# EAGLE design eeprom arduino (EAGLE 9.3.2)
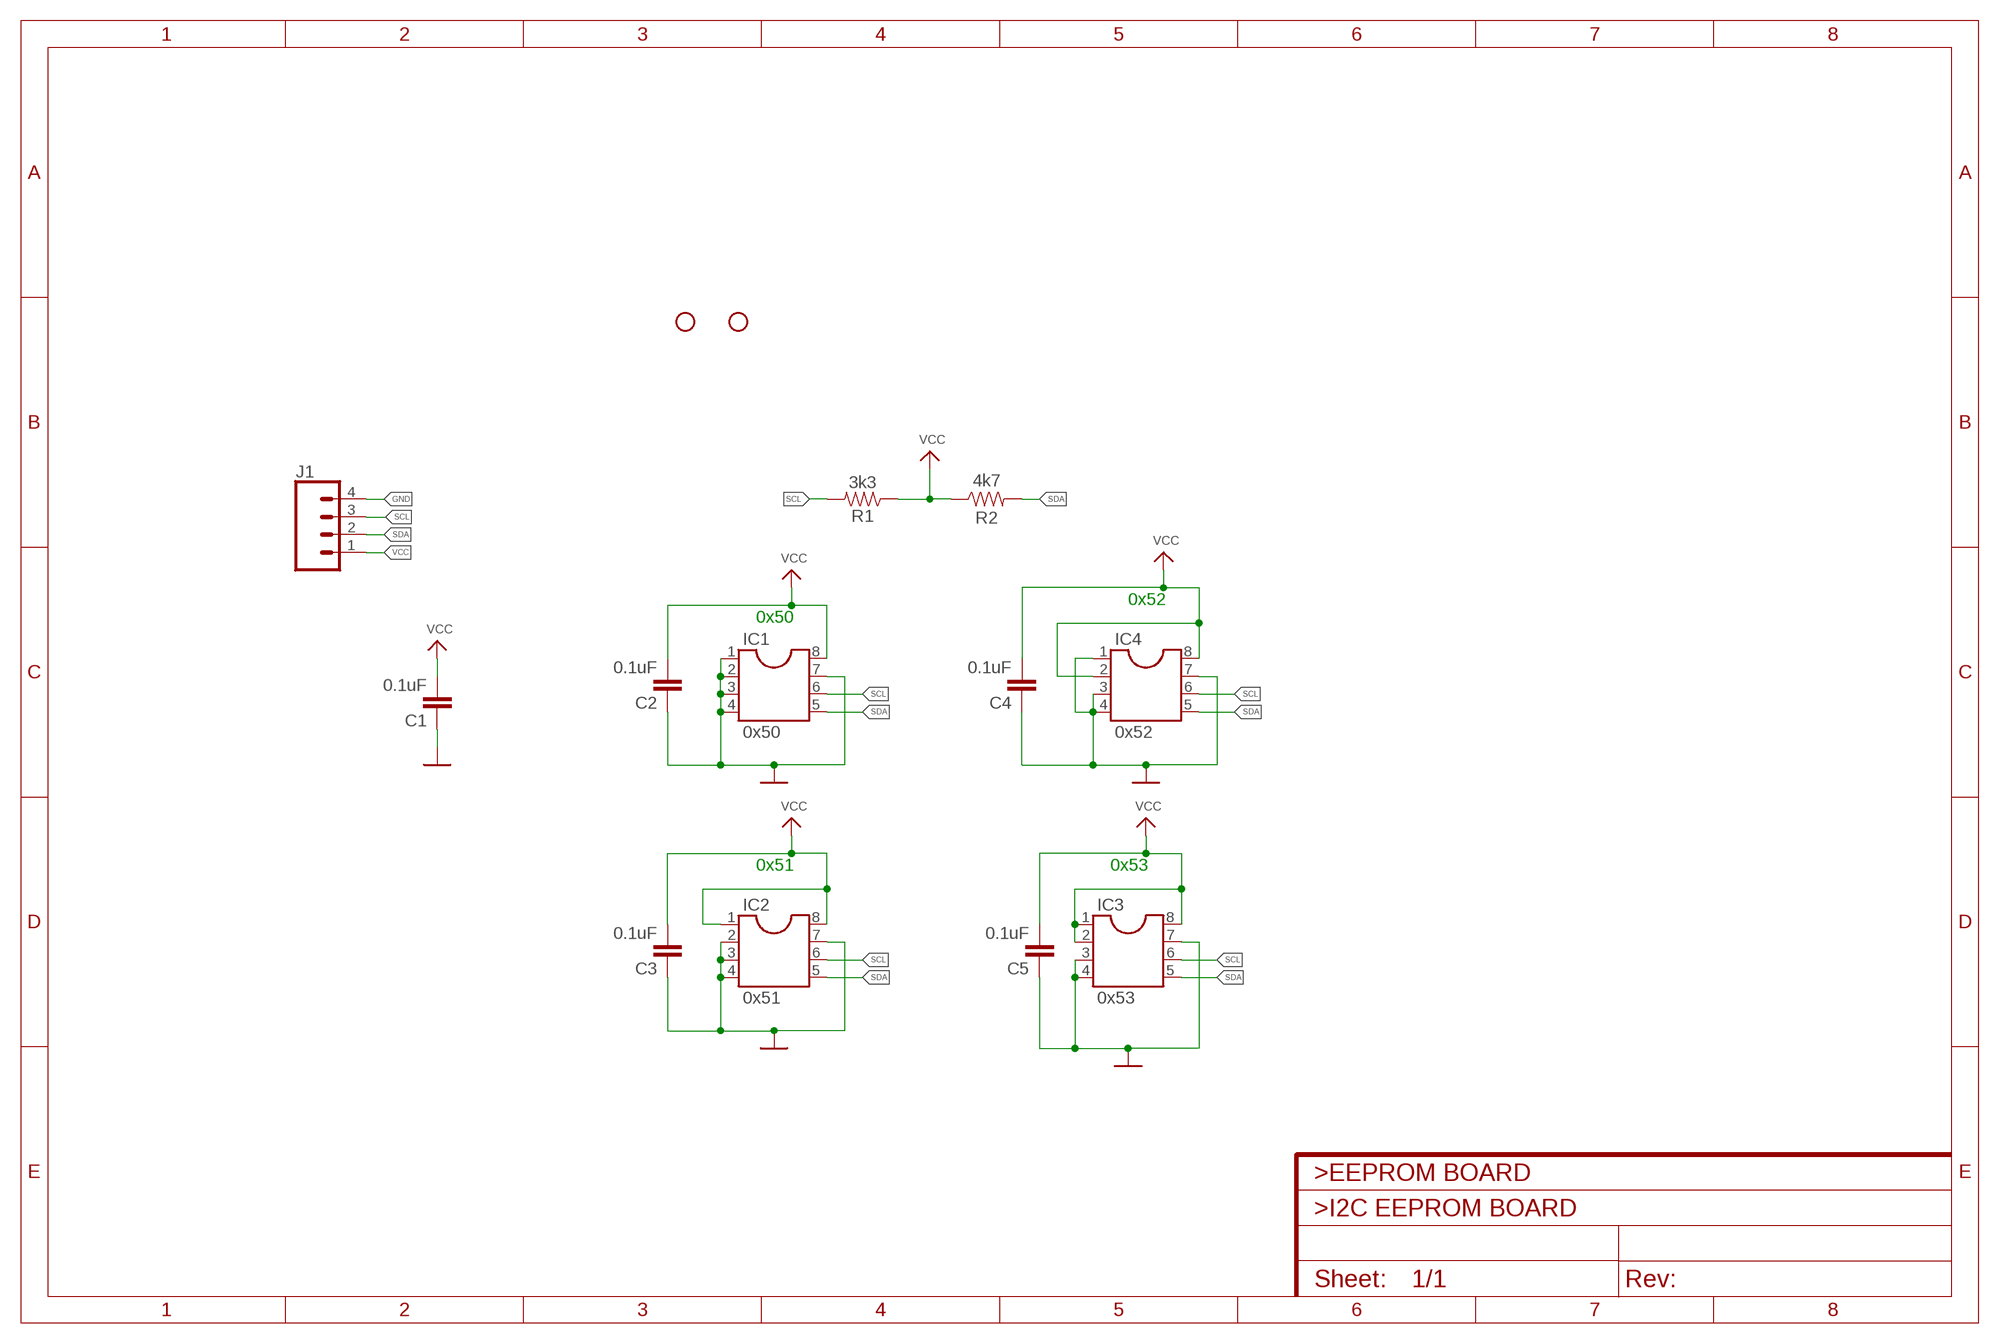
[diagram p0: schematic, sheet 1]

## Parts
C1  0.1uF  0.1UF-KIT-EZ-50V-20%  [CAP-PTH-SMALL-KIT]
C2  0.1uF  0.1UF-KIT-EZ-50V-20%  [CAP-PTH-SMALL-KIT]
C3  0.1uF  0.1UF-KIT-EZ-50V-20%  [CAP-PTH-SMALL-KIT]
C4  0.1uF  0.1UF-KIT-EZ-50V-20%  [CAP-PTH-SMALL-KIT]
C5  0.1uF  0.1UF-KIT-EZ-50V-20%  [CAP-PTH-SMALL-KIT]
H1  STAND-OFF  [STAND-OFF]
H2  STAND-OFF  [STAND-OFF]
IC1  0x50  DIL8S  [SOCKET-08]
IC2  0x51  DIL8S  [SOCKET-08]
IC3  0x53  DIL8S  [SOCKET-08]
IC4  0x52  DIL8S  [SOCKET-08]
J1  CONN_04POLAR  [MOLEX-1X4]
R1  3k3  10KOHM-HORIZ-1/4W-1%  [AXIAL-0.3]
R2  4k7  10KOHM-HORIZ-1/4W-1%  [AXIAL-0.3]

## Nets
GND [pwr]: C1.1 C2.1 C3.1 C4.1 C5.1 IC1.1 IC1.2 IC1.3 IC1.4 IC1.7 IC2.2 IC2.3 IC2.4 IC2.7 IC3.3 IC3.4 IC3.7 IC4.1 IC4.3 IC4.4 IC4.7 J1.4
SCL: IC1.6 IC2.6 IC3.6 IC4.6 J1.3 R1.P$2
SDA: IC1.5 IC2.5 IC3.5 IC4.5 J1.2 R2.P$2
VCC [pwr]: C1.2 C2.2 C3.2 C4.2 C5.2 IC1.8 IC2.1 IC2.8 IC3.1 IC3.2 IC3.8 IC4.2 IC4.8 J1.1 R1.P$1 R2.P$1

## Notes on the sheet
- 0x52
- 0x50
- 0x51 | 0x53

## Library data of the parts
C1-C5 = SparkFun-Capacitors:0.1UF: 0.1µF ceramic capacitors A capacitor is a passive two-terminal electrical component used to store electrical energy temporarily in an electric field.; PROD_ID: CAP-08370
H1 H2 = SparkFun-Hardware:STAND-OFF: Stand Off Drill holes for mechanically mounting via screws, standoffs, etc. Note: Use the keepout ring to avoid running the screw head into surrounding components. Variant Overviews STAND-OFF - Mechanical footprint for a #4 phillips button head screw. STAND-OFF-TIGHT - Mechanical footprint for a #4 phillips button head screw, Example SparkFun Products Screw - Phillips Head (1/4", 4-40, 10 pack) <https://www.sparkfun.com/products/10453> (PRT-10453) Screw - Phillips Head (1/2", 4-40, 10 pack) <https://www.sparkfun.com/products/10452> (PRT-10452) Screw - Phillips Head (3/4", 4-40, 10 pack) <https://www.sparkfun.com/products/10451> (PRT-10451) Screw - Phillips Head (1", 4-40, 10 pack) <https://www.sparkfun.com/products/10450> (PRT-10450)
IC1-IC4 = ic-package:DIL8: Dual In Line / Socket
J1 = SparkFun-Connectors:CONN_04: Multi connection point. Often used as Generic Header-pin footprint for 0.1 inch spaced/style header connections On any of the 0.1 inch spaced packages, you can populate with these: Break Away Headers - Straight <https://www.sparkfun.com/products/116> (PRT-00116) Break Away Male Headers - Right Angle <https://www.sparkfun.com/products/553> (PRT-00553) Female Headers <https://www.sparkfun.com/products/115> (PRT-00115) Break Away Headers - Machine Pin <https://www.sparkfun.com/products/117> (PRT-00117) Break Away Female Headers - Swiss Machine Pin <https://www.sparkfun.com/products/743> (PRT-00743) For SCREWTERMINALS and SPRING TERMINALS visit here: Screw Terimnals on SparkFun.com <https://www.sparkfun.com/search/results?term=Screw+Terminals> (5mm/3.5mm/2.54mm spacing) This device is also useful as a general connection point to wire up your design to another part of your project. Our various solder wires solder well into these plated through hole pads. Hook-Up Wire - Assortment (Stranded, 22 AWG) <https://www.sparkfun.com/products/11375> (PRT-11375) Hook-Up Wire - Assortment (Solid Core, 22 AWG) <https://www.sparkfun.com/products/11367> (PRT-11367) View the entire wire category on our website here <https://www.sparkfun.com/categories/141> Special notes: Molex polarized connector foot print use with SKU : PRT-08231 with associated crimp pins and housings. 1MM SMD Version SKU: PRT-10208; PROD_ID: CONN-08186; SF_ID: PRT-08231
R1 R2 = SparkFun-Resistors:10KOHM: 10kΩ resistor A resistor is a passive two-terminal electrical component that implements electrical resistance as a circuit element. Resistors act to reduce current flow, and, at the same time, act to lower voltage levels within circuits. - Wikipedia; PROD_ID: RES-12183; VALUE: 10k

## Net classes
1 pwr: width 0.508 mm, drill 0.254 mm, clearance 0.381 mm

## Board
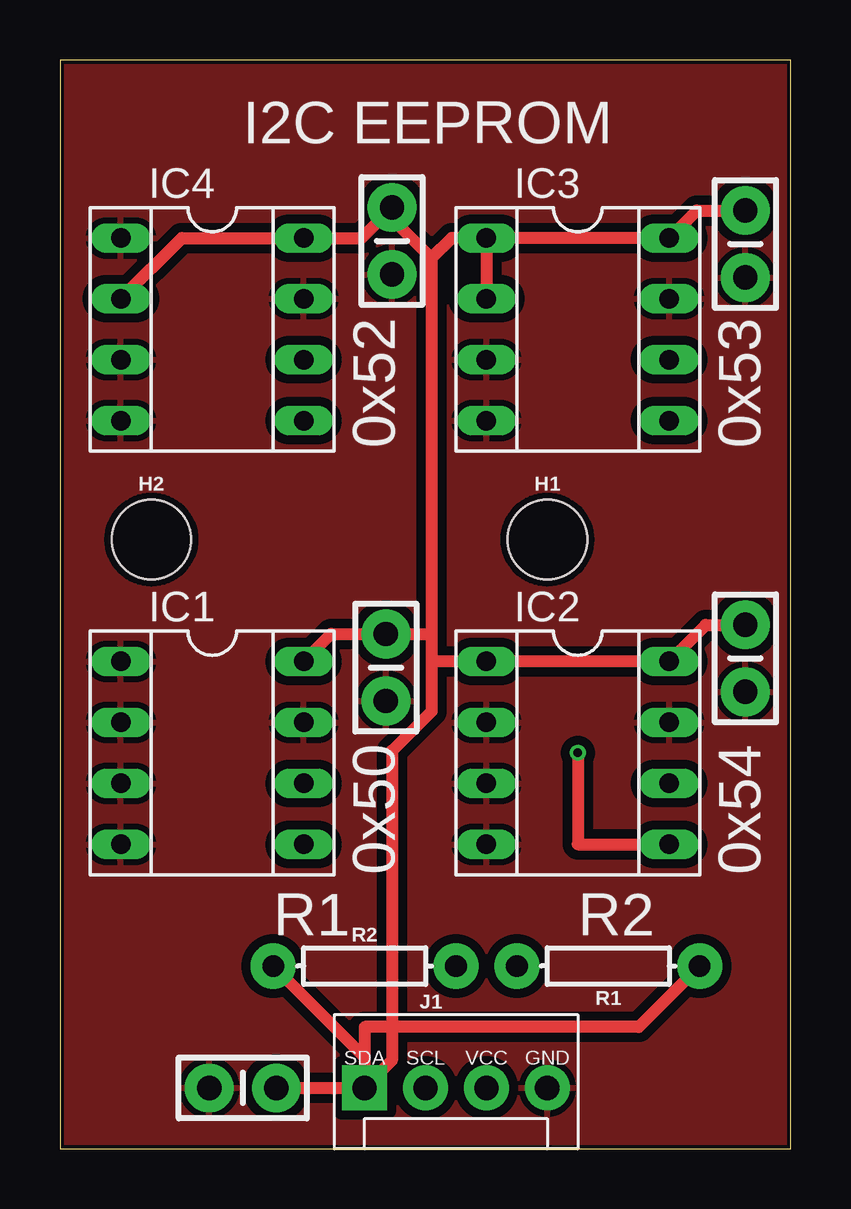
[diagram p1: board, top side]
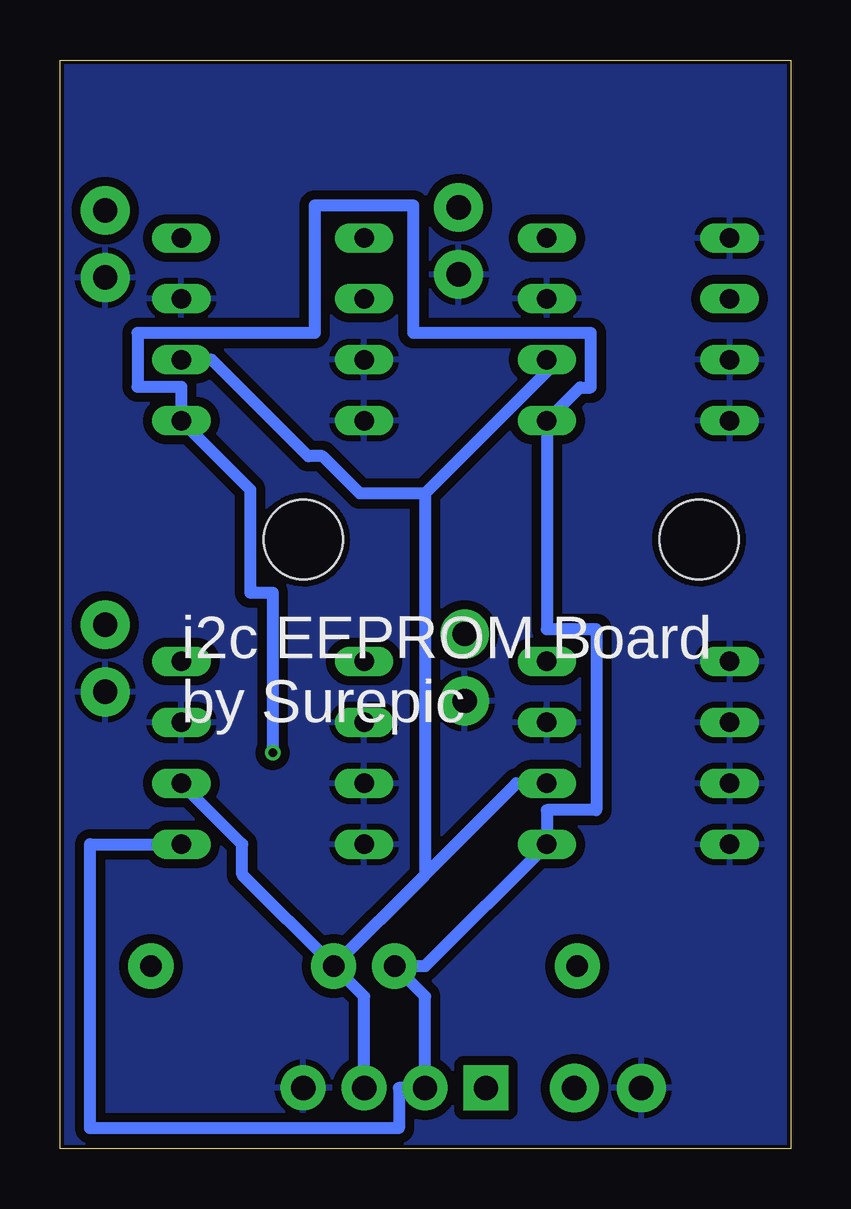
[diagram p2: board, bottom side, seen from below]

Size 30.46 x 45.39 mm. Coordinates in mm from the lower left corner, seen from the top.
Outline: 0,0 30.46,0 30.46,45.39 0,45.39 0,0
Copper layers (1*16): Top 0.035mm / dielectric 1.5mm / Bottom 0.035mm
Design rules "SparkFun-2-layer-PCBWay-LIMIT": minimum track width 6mil, minimum drill 0.3mm, track to track 6mil, track to pad 6mil, pad to pad 6mil, via to via 6mil, smd to smd 6mil, copper to edge 6mil, drill to drill 6mil, minimum pad ring 6mil, minimum via ring 6mil, stop-mask expansion 4mil, vias tented up to drill 25mil, thermal gap 10mil

### Footprints (pad centres in the part's own frame; a part is rotated, then mirrored left to right if it is on the bottom)
CAP-PTH-SMALL-KIT = drill 1.016 pad 2.032: 1 -1.397,0; 2 1.397,0
STAND-OFF = hole 3.302: 0,0
SOCKET-08 = drill 0.813 long: 1 -3.81,-3.81; 2 -1.27,-3.81; 3 1.27,-3.81; 4 3.81,-3.81; 5 3.81,3.81; 6 1.27,3.81; 7 -1.27,3.81; 8 -3.81,3.81
MOLEX-1X4 = drill 1.016 pad 1.88 square: 1 0,0 | drill 1.016 pad 1.88: 2 2.54,0; 3 5.08,0; 4 7.62,0
AXIAL-0.3 = drill 0.9 pad 1.88: P$1 -3.81,0; P$2 3.81,0

### Placement (x,y rotation side)
C1  7.62,2.54 0 top
C2  13.59,20.07 90 top
C3  28.57,20.45 90 top
C4  13.84,37.85 90 top
C5  28.57,37.72 90 top
H1  20.32,25.4 0 top
H2  3.81,25.4 0 top
IC1  6.35,16.51 270 top
IC2  21.59,16.51 270 top
IC3  21.59,34.16 270 top
IC4  6.35,34.16 270 top
J1  12.7,2.54 0 top
R1  22.86,7.62 180 top
R2  12.7,7.62 0 top

### Tracks (layer width: path | path; a pad name or v marks a point on that pad's centre or on a via)
GND
  pour Top: 0,0 0,45.72 30.48,45.72 30.48,0
  pour Bottom: 0,0 0,45.72 30.48,45.72 30.48,0
SCL
  Bottom 0.508: J1.3 17.78,6.35 R1.P$2 | R1.P$2 22.86,11.43 22.86,12.7 IC2.6 | R1.P$2 15.24,11.43 | 15.24,11.43 11.43,15.24 IC1.6 | IC4.6 10.16,32.4 15.24,27.32 | 15.24,27.32 15.24,11.43 | 15.24,27.32 17.95,27.32 19.51,28.88 20.11,28.88 24.13,32.89 IC3.6
SDA  (via drill 0.35)
  Top 0.508: v21.59,16.51 21.59,12.7 IC2.5
  Bottom 0.508: IC2.5 29.21,12.7 29.21,0.86 16.33,0.86 16.33,2.54 J1.2 15.24,6.35 R2.P$2 15.24,7.62 IC1.5 10.16,14.12 8.1,14.12 8.1,21.67 10.16,21.67 IC4.5 8.77,31.74 8.33,31.74 8.33,34.01 15.72,34.01 15.72,39.32 19.84,39.32 19.84,34.01 27.23,34.01 27.23,31.77 25.4,31.77 IC3.5 22.53,27.48 22.53,23.19 21.59,23.19 v21.59,16.51
VCC
  Top 0.508: IC4.2 5.08,37.97 IC4.8 12.57,37.97 C4.2 13.84,38.78 15.49,37.13 | C5.2 26.54,39.12 IC3.8 IC3.1 | IC3.1 IC3.2 | IC1.8 11.3,21.46 C2.2 15.37,21.46 15.49,21.59 | C3.2 26.92,21.84 IC2.8 IC2.1 15.49,20.32 | C1.2 J1.1 | R2.P$1 12.7,3.81 J1.1 | R1.P$1 24.13,5.08 12.7,5.08 J1.1 | J1.1 13.84,3.68 13.84,16.59 15.49,18.24 15.49,20.32 | 15.49,37.13 15.49,21.59 | 15.49,21.59 15.49,20.32 | IC3.1 16.33,37.97 15.49,37.13

### Text on the board
tPlace: I2C EEPROM | 0x52 | 0x53 | 0x50 | 0x54 | R1 | R2 | SDA | SCL | VCC | GND
bPlace: i2c EEPROM Board / by Surepic